# Altium schematic sheet MCU_STM32G0_Extender.SchDoc: STM32F446 CNC
size B; Author: AM; CompanyName: Expatria Technologies; DrawnBy: A.Marles; Engineer: AM; Organization: Expatria Technologies; DocumentNumber: 3; SheetNumber: 3; SheetTotal: 14
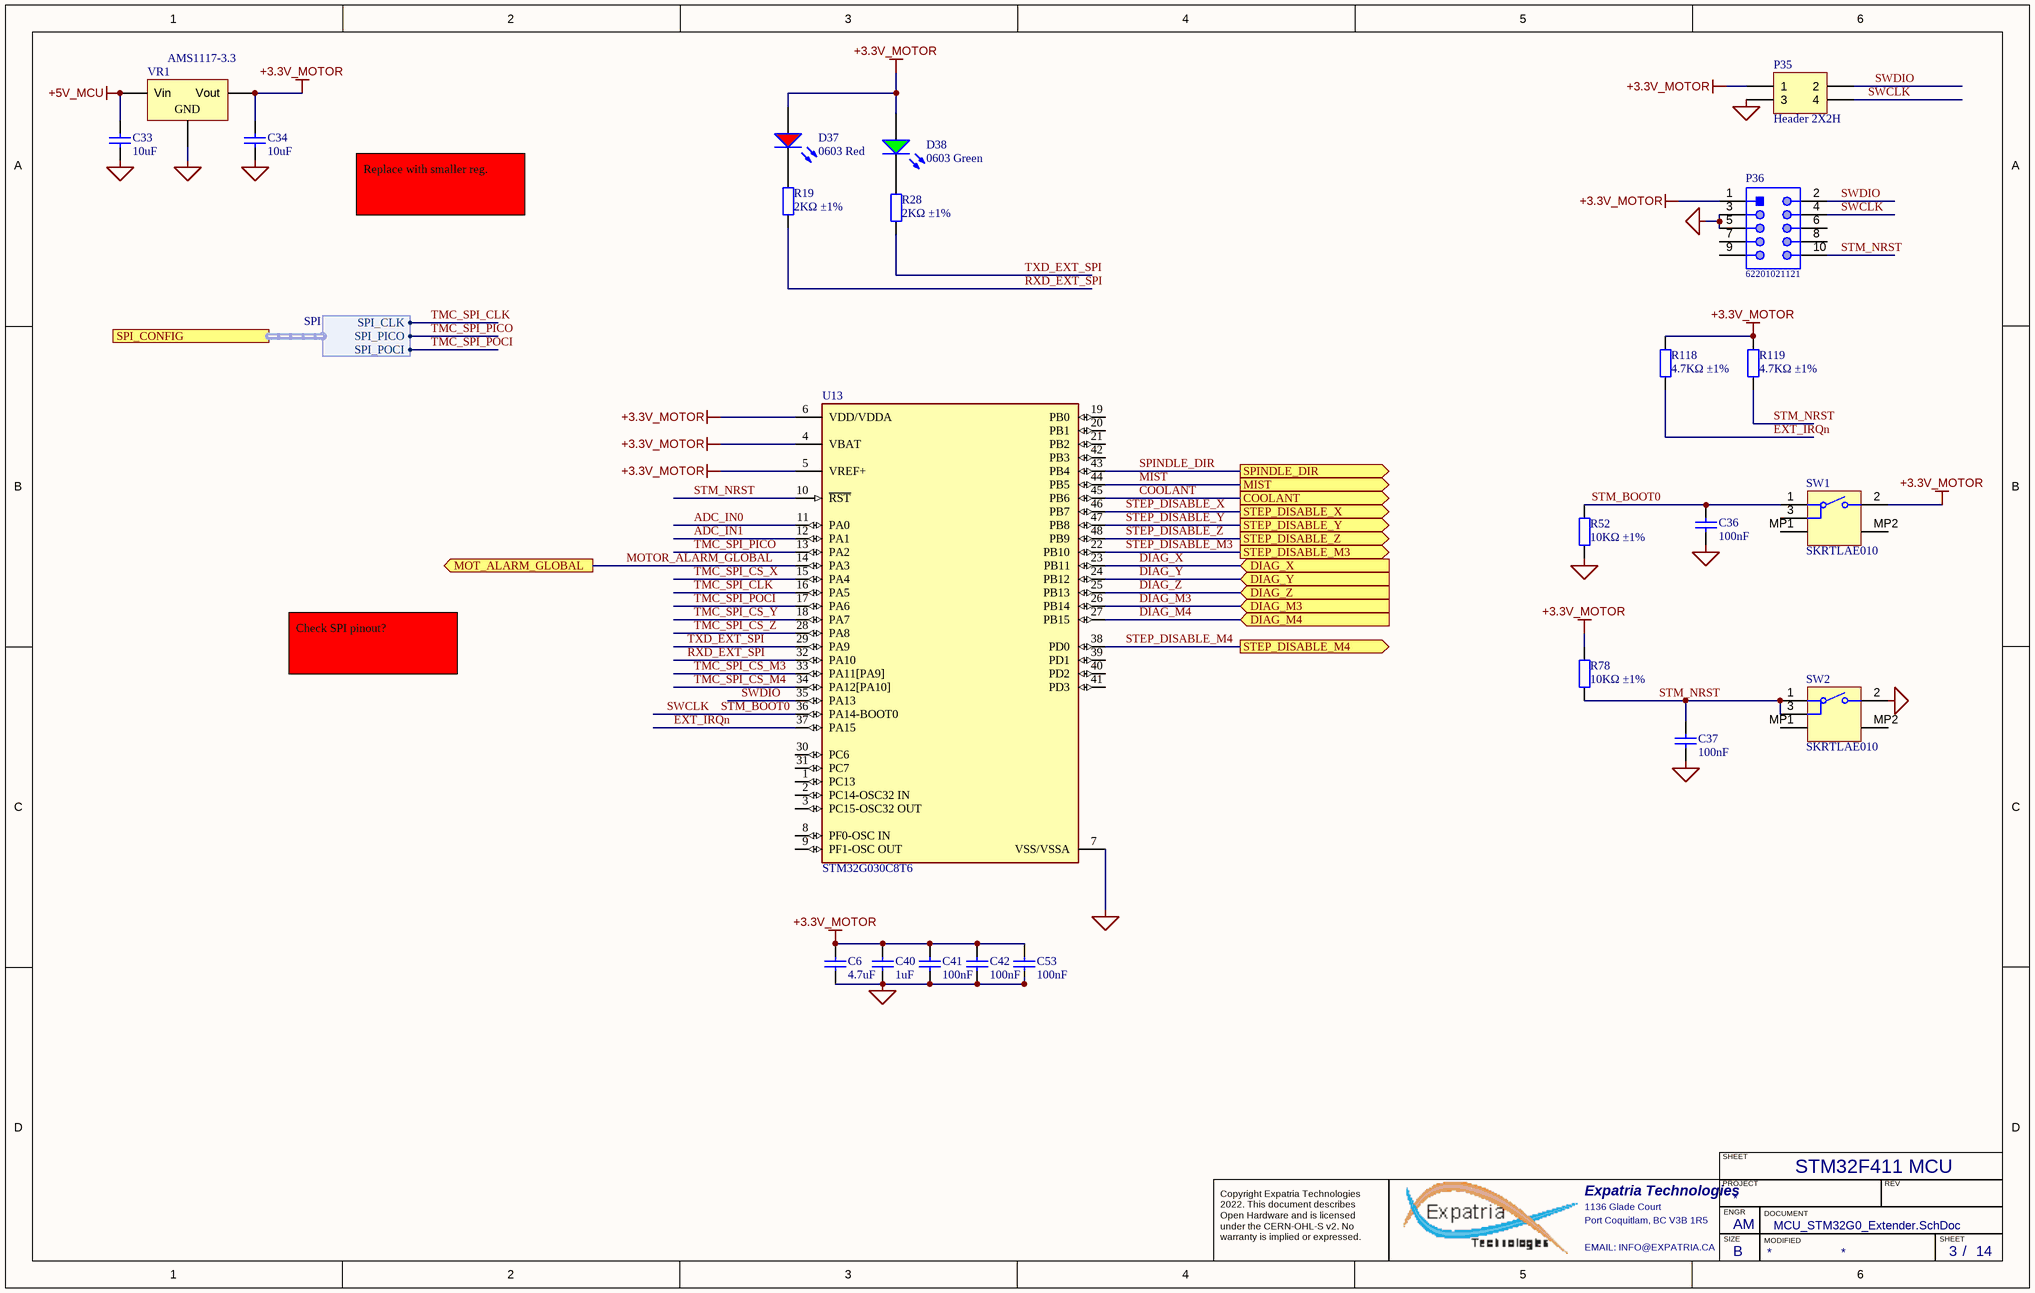
[diagram p0: MCU_STM32G0_Extender.SchDoc]

## Parts
C6  4.7uF  [0603_C]
C33  10uF  [1206_C]
C34  10uF  [1206_C]
C36  100nF  [0603_C]
C37  100nF  [0603_C]
C40  1uF  [0603_C]
C41  100nF  [0603_C]
C42  100nF  [0603_C]
C53  100nF  [0603_C]
D37  0603 Red  [0603_LED_S1]
D38  0603 Green  [0603_LED_S1]
P35  Header 2X2H  [HDR2X2H]
P36  62201021121  [62201021121]  (no BOM)
R19  2KΩ ±1%  [0603_R]
R28  2KΩ ±1%  [0603_R]
R52  10KΩ ±1%  [0603_R]
R78  10KΩ ±1%  [0603_R]
R118  4.7KΩ ±1%  [0603_R]
R119  4.7KΩ ±1%  [0603_R]
SW1  SKRTLAE010  [ALPS-SKRTLAE010_V]
SW2  SKRTLAE010  [ALPS-SKRTLAE010_V]
U13  STM32G030C8T6  [FP-LQFP48-5B-IPC_A]
VR1  AMS1117-3.3  [SOT-223]

## Ports
COOLANT (out), DIAG_M3 (in), DIAG_M4 (in), DIAG_X (in), DIAG_Y (in), DIAG_Z (in), MIST (out), MOT_ALARM_GLOBAL (out), SPI_CONFIG (harness SPI), SPINDLE_DIR (out), STEP_DISABLE_M3 (out), STEP_DISABLE_M4 (out), STEP_DISABLE_X (out), STEP_DISABLE_Y (out), STEP_DISABLE_Z (out)

## Harnesses
SPI: SPI_CLK, SPI_PICO, SPI_POCI

## Nets
+3.3V_MOTOR: C6.2 C34.2 C40.2 C41.2 C42.2 C53.2 D37.A D38.A P35.1 P36.1 R78.1 R118.2 R119.2 SW1.2 U13.4(VBAT) U13.5(VREF+) U13.6(VDD/VDDA) VR1.2(Vout)
+5V_MCU: C33.2 VR1.3(Vin)
MCU_GND: C6.1 C33.1 C34.1 C36.1 C37.1 C40.1 C41.1 C42.1 C53.1 P35.3 P36.3 P36.5 R52.2 SW2.2 U13.7(VSS/VSSA) VR1.1(GND)
ADC_IN0: U13.11(PA0)
ADC_IN1: U13.12(PA1)
COOLANT: U13.45(PB6) ; port COOLANT
DIAG_M3: U13.26(PB14) ; port DIAG_M3
DIAG_M4: U13.27(PB15) ; port DIAG_M4
DIAG_X: U13.23(PB11) ; port DIAG_X
DIAG_Y: U13.24(PB12) ; port DIAG_Y
DIAG_Z: U13.25(PB13) ; port DIAG_Z
EXT_IRQn: R118.1 U13.37(PA15)
MIST: U13.44(PB5) ; port MIST
MOTOR_ALARM_GLOBAL: U13.14(PA3) ; port MOT_ALARM_GLOBAL
RXD_EXT_SPI: R19.1 U13.32(PA10)
SPINDLE_DIR: U13.43(PB4) ; port SPINDLE_DIR
STEP_DISABLE_M3: U13.22(PB10) ; port STEP_DISABLE_M3
STEP_DISABLE_M4: U13.38(PD0) ; port STEP_DISABLE_M4
STEP_DISABLE_X: U13.46(PB7) ; port STEP_DISABLE_X
STEP_DISABLE_Y: U13.47(PB8) ; port STEP_DISABLE_Y
STEP_DISABLE_Z: U13.48(PB9) ; port STEP_DISABLE_Z
STM_BOOT0: C36.2 P35.4 P36.4 R52.1 SW1.1 U13.36(PA14-BOOT0)  [also labelled SWCLK]
STM_NRST: C37.2 P36.10 R78.2 R119.1 SW2.1 SW2.3 U13.10(~{RST})
SWDIO: P35.2 P36.2 U13.35(PA13)
TMC_SPI_CLK: U13.16(PA5) ; port SPI_CONFIG.SPI_CLK
TMC_SPI_CS_M3: U13.33(PA11[PA9])
TMC_SPI_CS_M4: U13.34(PA12[PA10])
TMC_SPI_CS_X: U13.15(PA4)
TMC_SPI_CS_Y: U13.18(PA7)
TMC_SPI_CS_Z: U13.28(PA8)
TMC_SPI_PICO: U13.13(PA2) ; port SPI_CONFIG.SPI_PICO
TMC_SPI_POCI: U13.17(PA6) ; port SPI_CONFIG.SPI_POCI
TXD_EXT_SPI: R28.1 U13.29(PA9)
NetD37_K: D37.K R19.2
NetD38_K: D38.K R28.2

Not connected (* = marked no-connect by the designer): P36 6 7 8 9; SW1 3 MP1 MP2; SW2 MP1 MP2; U13 1(PC13) 2(PC14-OSC32_IN) 3(PC15-OSC32_OUT) 8(PF0-OSC_IN) 9(PF1-OSC_OUT) 19(PB0) 20(PB1) 21(PB2) 30(PC6) 31(PC7) 39(PD1) 40(PD2) 41(PD3) 42(PB3)

## Notes on the sheet
- Replace with smaller reg.
- Check SPI pinout?
- STM32F411 MCU
- SHEET
- Expatria Technologies
- 1136 Glade Court
- Port Coquitlam, BC V3B 1R5
- PROJECT
- SIZE
- ENGR
- MODIFIED
- DOCUMENT
- REV
- Copyright Expatria Technologies 2022. This document describes Open Hardware and is licensed under the CERN-OHL-S v2. No warranty is implied or expressed.
- EMAIL: INFO@EXPATRIA.CA
- B
- /

## Library data of the parts
C6 = 0603 4.7uF (475) 10% 16V: Chip capacitors; Manufacturer: Samsung Electro-Mechanics; PartNumber: CL10A475KO8NNNC; Tolerance: 10%; Voltage: 16V; ComponentLink1Description: Supplier link; ComponentLink1URL: http://www.szlcsc.com/product/details_20375.html; Package: 0603; Supplier: LC; SuppliersPartNumber: C19666; Capacitance: 4.7uF
C33 C34 = 1206 10uF (106) 10% 50V: Chip capacitors; Manufacturer: Samsung Electro-Mechanics; PartNumber: CL31A106KBHNNNE; Tolerance: 10%; Voltage: 50V; ComponentLink1Description: Supplier link; ComponentLink1URL: http://www.szlcsc.com/product/details_14236.html; Package: 1206; Supplier: LC; SuppliersPartNumber: C13585; Capacitance: 10uF; Manufacturer 1: Samsung Electro-Mechanics
C36 C37 C41 C42 C53 = 0603 100nF (104) 10% 50V: Chip capacitors; Manufacturer: YAGEO; PartNumber: CC0603KRX7R9BB104; Tolerance: 10%; Voltage: 50V; ComponentLink1Description: Supplier link; ComponentLink1URL: http://www.szlcsc.com/product/details_15331.html; Package: 0603; Supplier: LC; SuppliersPartNumber: C14663; Capacitance: 100nF
C40 = 0603 1uF (105) 10% 50V: Chip capacitors; Manufacturer: Samsung Electro-Mechanics; PartNumber: CL10A105KB8NNNC; Tolerance: 10%; Voltage: 50V; ComponentLink1Description: Supplier link; ComponentLink1URL: http://www.szlcsc.com/product/details_16531.html; Package: 0603; Supplier: LC; SuppliersPartNumber: C15849; Capacitance: 1uF
D37 = 0603 LED Red: LED; ComponentLink1Description: 供应商链接; ComponentLink1URL: http://www.szlcsc.com/product/details_2659.html; Package: 0603; Supplier: LC; SuppliersPartNumber: C2286; Color: Red
D38 = 0603 LED Green: LED; ComponentLink1Description: 供应商链接; ComponentLink1URL: http://www.szlcsc.com/product/details_73152.html; Package: 0603; Supplier: LC; SuppliersPartNumber: C72043; Color: Green
P35 = Header 2X2H: Header, 2-Pin, Dual row, Right Angle; LatestRevisionDate: 17-Jul-2002; LatestRevisionNote: Re-released for DXP Platform.; Publisher: Altium Limited
P36 = CMP-1502-00948-1: THT Vertical Pin Header WR-PHD, Pitch 1.27 mm, Dual Row, 10 pins; Manufacturer: Wurth Elektronik; Rated Current: 1A; Pin Number: 10; Working Voltage: 100VAC; Contact Resistance: 20mOhm; Withstanding Voltage: 500VAC; Pitch: 1.27mm; Gender: Male; Mounting Technology: THT; Manufacturer URL: http://www.we-online.de; Package Reference: 62201021121; Row Number: Dual; Datasheet URL: https://katalog.we-online.de/em/datasheet/62201021121.pdf; Publisher: WurthElektronik; Packaging: Box; Operating Temperature: -40to105degC; Orientation: Vertical; Part Number: 62201021121
R19 R28 = 0603 2K (2001) 1%: Chip resistor; Manufacturer: Uniroyal Elec; PartNumber: 0603WAF2001T5E; Power: 1/10W; ComponentLink1Description: Supplier link; ComponentLink1URL: http://www.szlcsc.com/product/details_23702.html; Package: 0603; Supplier: LC; SuppliersPartNumber: C22975; Resistance: 2KΩ; Tolerance: 1%
R52 R78 = 0603 10K (1002) 1%: Chip resistor; Manufacturer: Uniroyal Elec; PartNumber: 0603WAF1002T5E; Power: 1/10W; ComponentLink1Description: Supplier link; ComponentLink1URL: http://www.szlcsc.com/product/details_26547.html; Package: 0603; Supplier: LC; SuppliersPartNumber: C25804; Resistance: 10KΩ; Tolerance: 1%
R118 R119 = 0603 4.7K (4701) 1%: Chip resistor; Manufacturer: Uniroyal Elec; PartNumber: 0603WAF4701T5E; Power: 1/10W; ComponentLink1Description: Supplier link; ComponentLink1URL: http://www.szlcsc.com/product/details_23889.html; Package: 0603; Supplier: LC; SuppliersPartNumber: C23162; Resistance: 4.7KΩ; Tolerance: 1%
SW1 SW2 = CMP-2000-07073-2: Side Push Type, 250 V, -40 to 90 degC, 3-Pin SMD, RoHS, Tape and Reel; Manufacturer: ALPS; Operating Force: 1.6N; Folder: Unified Components\Components\New Releases\New\; Maximum Current Rating: 0.05@12VDCA; RevisionId: 1; Pole Throw Configuration: SPST; Switch Configuration: N.O.; AccessRights: 2147483647; Maximum DC Voltage Rating: 12V; ContentType: Unified Component; Rad Hard: No; Mounting: SurfaceMount; Datasheet URL: http://www.alps.com/prod/info/E/PDF/Tact/SurfaceMount/SKRT/SKRT.PDF; Manufacturer URL: http://www.alps.com/e/; ReleaseDate: 22/09/2017 06:13:25 AM; ItemHRID: CMP-2000-07073; ContentTypeGUID: CB3C11C4-E317-11DF-B822-12313F0024A2; LifeCycle: Released; ItemGUID: EAC55BEC-37DC-4BDB-8BA7-D75E6D5C3D75; Packaging: Tape&Reel; Package Reference: SKRTLAE010; FolderGUID: B7F4506A-9127-42E7-A087-46FE7B18D116; Datasheet Version: 06/2015; Mounting Technology: SurfaceMount; LifeCycleStateGUID: 61E382EE-6656-4F12-9E24-BE9327104A25; Package Description: 3-Pin Surface Mount Device, Body 4.5 x 3.55 mm, Pitch 1.225 mm; SuppliersPartNumber: C110293; Manufacturer 1: ALPS
U13 = CMP-12105-000142-1: IC MCU 32BIT 64KB FLASH 48LQFP; RoHS Compliant: Yes
VR1 = SOT-223 AMS1117-3.3: Vout=3.3V 1A 72dB@(120Hz) (LDO); Manufacturer 1: AMS; ComponentLink1Description: 供应商链接; ComponentLink1URL: http://www.szlcsc.com/product/details_6652.html; Package: SOT-223; Supplier: LC; SuppliersPartNumber: C6186; Manufacturer Part Number 1: AMS1117-3.3